# Altium schematic sheet CTR_MCU_Circuits.SchDoc: TMS320 Circuits
size A4; DrawnBy: Andrei Divinagracia; Revision: 0A; SheetNumber: 6; SheetTotal: 10
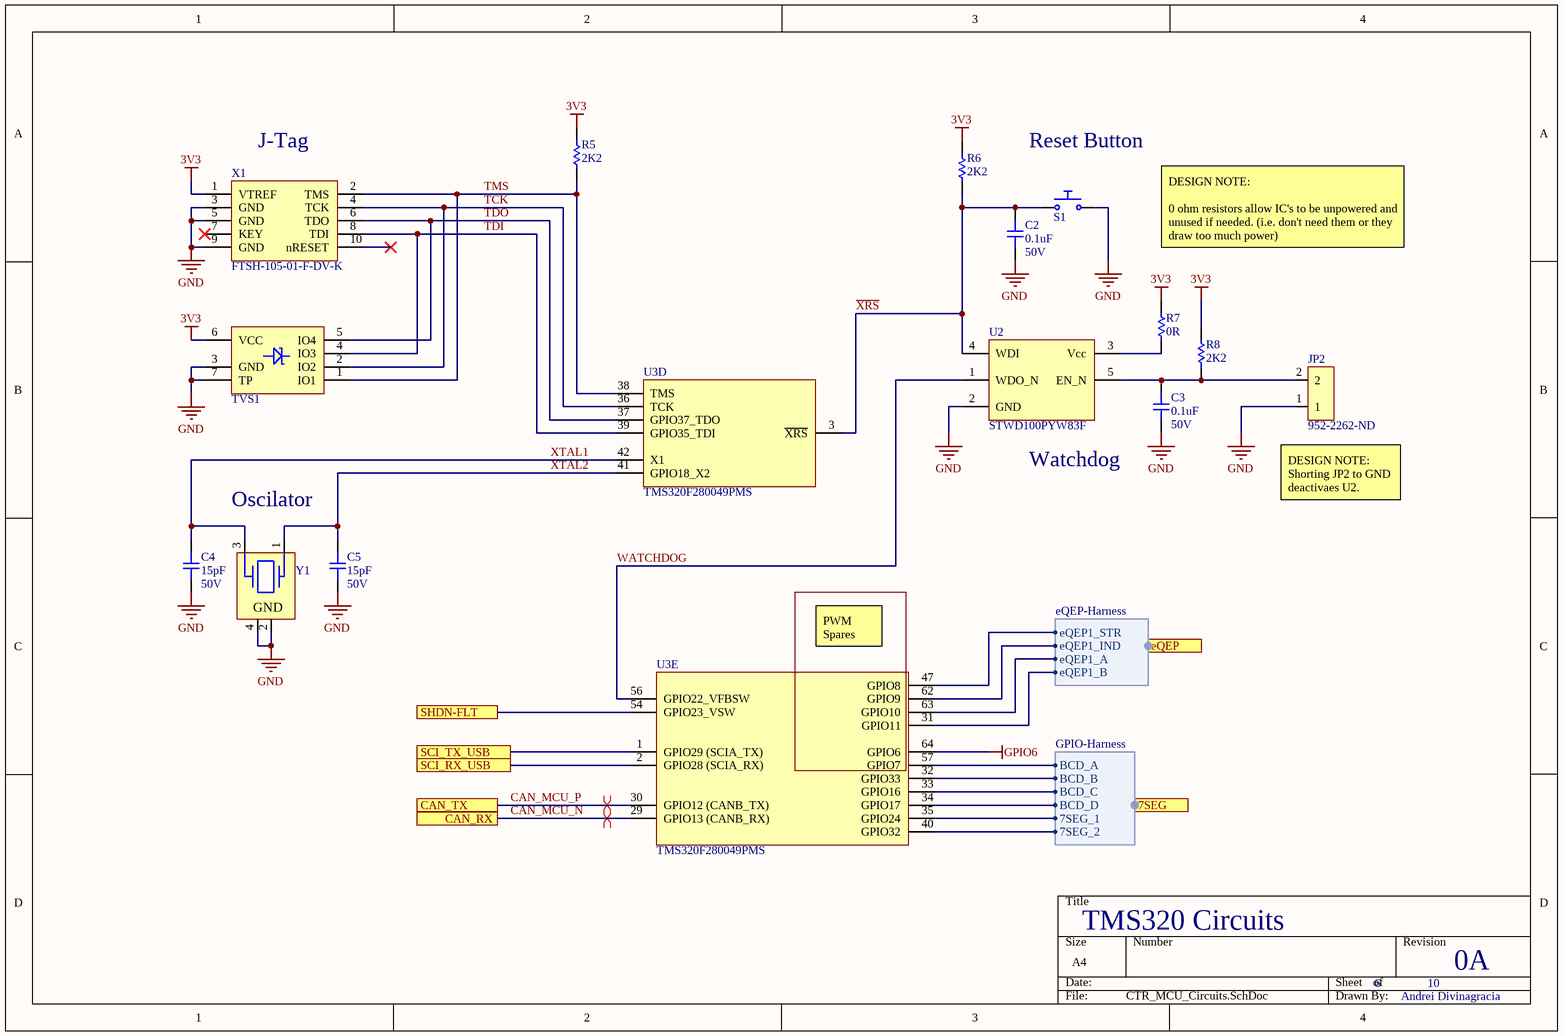
[diagram p0: CTR_MCU_Circuits.SchDoc]

## Parts
C2  0.1uF  Voltage Rating: 50V  [CAP-0805]
C3  0.1uF  Voltage Rating: 50V  [CAP-0805]
C4  15pF  Voltage Rating: 50V  [CAP-0603]
C5  15pF  Voltage Rating: 50V  [CAP-0603]
JP2  952-2262-ND  [2PIN_HEADER]
R5  2K2  [RES-0603]
R6  2K2  [RES-0603]
R7  0R  [RES-0603]
R8  2K2  [RES-0603]
S1  PTS645SM43SMTR92LFS  [PUSH_BUTTON]  (value not drawn)
TVS1  TVS-4-5.5V-Bi  [TVS-DRS-TP-5]  (value not drawn)
U2  STWD100PYW83F  [SOT23-5-WATCHDOG]
U3  TMS320F280049PMS  [64QFP]  (parts D,E of 5)
X1  FTSH-105-01-F-DV-K  [JTAG_50mil_10pin]
Y1  ECS-200-18-30B-AGN-TR  [XTAL-SMD-4]  (value not drawn)

## Ports
7SEG (harness GPIO-Harness), CAN_RX, CAN_TX, eQEP (harness eQEP-Harness), SCI_RX_USB, SCI_TX_USB, SHDN-FLT

## Harnesses
eQEP-Harness: eQEP1_A, eQEP1_B, eQEP1_IND, eQEP1_STR
GPIO-Harness: 7SEG_2, 7SEG_1, BCD_C, BCD_B, BCD_A, BCD_D

## Nets
3V3: R5.1 R6.1 R7.2 R8.2 TVS1.6(VCC) X1.1(VTREF)
GND: C2.1 C3.1 C4.1 C5.1 JP2.1 S1.2 TVS1.3(GND) TVS1.7(TP) U2.2(GND) X1.3(GND) X1.5(GND) X1.9(GND) Y1.2(GND) Y1.4(GND)
GPIO6: U3.64(GPIO6)
CAN_MCU_N: U3.29(GPIO13_(CANB_RX)) ; port CAN_RX
CAN_MCU_P: U3.30(GPIO12_(CANB_TX)) ; port CAN_TX
SCI_RX_USB: U3.2(GPIO28_(SCIA_RX)) ; port SCI_RX_USB
SCI_TX_USB: U3.1(GPIO29_(SCIA_TX)) ; port SCI_TX_USB
SHDN-FLT: U3.54(GPIO23_VSW) ; port SHDN-FLT
TCK: TVS1.2(IO2) U3.36(TCK) X1.4(TCK)
TDI: TVS1.4(IO3) U3.39(GPIO35_TDI) X1.8(TDI)
TDO: TVS1.5(IO4) U3.37(GPIO37_TDO) X1.6(TDO)
TMS: R5.2 TVS1.1(IO1) U3.38(TMS) X1.2(TMS)
WATCHDOG: U2.1(WDO_N) U3.56(GPIO22_VFBSW)
~{XRS}: C2.2 R6.2 S1.1 U2.4(WDI) U3.3(~{XRS})
XTAL1: C4.2 U3.42(X1) Y1.3(OUT)
XTAL2: C5.2 U3.41(GPIO18_X2) Y1.1(IN)
NetC3_2: C3.2 JP2.2 R8.1 U2.5(EN_N)
NetR7_1: R7.1 U2.3(Vcc)
NetU3_31: U3.31(GPIO11) ; port eQEP.eQEP1_B
NetU3_32: U3.32(GPIO33) ; port 7SEG.BCD_B
NetU3_33: U3.33(GPIO16) ; port 7SEG.BCD_C
NetU3_34: U3.34(GPIO17) ; port 7SEG.BCD_D
NetU3_35: U3.35(GPIO24) ; port 7SEG.7SEG_1
NetU3_40: U3.40(GPIO32) ; port 7SEG.7SEG_2
NetU3_47: U3.47(GPIO8) ; port eQEP.eQEP1_STR
NetU3_57: U3.57(GPIO7) ; port 7SEG.BCD_A
NetU3_62: U3.62(GPIO9) ; port eQEP.eQEP1_IND
NetU3_63: U3.63(GPIO10) ; port eQEP.eQEP1_A

Not connected (* = marked no-connect by the designer): X1 7(KEY)* 10(nRESET)*

## Layout directives
differential pair: CAN_MCU_N, CAN_MCU_P

## Notes on the sheet
- (near X1) J-Tag
- Reset Button
- DESIGN NOTE:
  0 ohm resistors allow IC's to be unpowered and unused if needed. (i.e. don't need them or they draw too much power)
- Oscilator
- Watchdog
- (near JP2) DESIGN NOTE:
  Shorting JP2 to GND deactivaes U2.
- (near U3) PWM Spares

## Library data of the parts
C2 C3 = 0805-0.1uF-50V: CAP CER 0.1UF 50V Y5V 0805; Manufacturer: KEMET; Manufacturer Part Number: C0805C104Z5VACTU; Dielectric Material: Ceramic; Tolerance: 80%; Dissipation Factor: 5%; Capacitance: 100nF; Supplier 1: Digi-Key; Stock 1: 929243; Pricing 1: 1=0.1, 10=0.057, 100=0.0254, 500=0.01818, 1000=0.01428 (USD); Mount: Surface Mount,PCB; Case/Package: 0805; Number of Pins: 2; Case Code (Metric): 2012; Case Code (Imperial): 0805; Min Operating Temperature: -30°C; Max Operating Temperature: 85°C; Package Quantity: 1; Packaging: Tape and Reel; Voltage Rating (DC): 50V; Dielectric: Y5V; Termination: SMD/SMT; Voltage: 50V; Length: 2mm; Height: 0.9mm; Lead Pitch: 0.75mm; Width: 0.049inch; Thickness: 0.039inch; Depth: 1.25mm; Radiation Hardening: No; REACH SVHC: No SVHC; Lead Free: Lead Free; ComponentLink1URL: http://www.alliedelec.com/m/d/9bfe7773041ffe9d406e68bc7b377fdd.pdf?src-supplier=Allied+Electronics; ComponentLink1Description: http://www.alliedelec.com/m/d/9bfe7773041ffe9d406e68bc7b377fdd.pdf?src-supplier=Allied+Electronics; ComponentLink2URL: https://www.verical.com/server-webapp/html/getDatasheet?partID=37101&src-supplier=Verical; ComponentLink2Description: https://www.verical.com/server-webapp/html/getDatasheet?partID=37101&src-supplier=Verical; ComponentLink3URL: https://www.verical.com/server-webapp/html/getDatasheet?partID=321176&src-supplier=Verical; ComponentLink3Description: https://www.verical.com/server-webapp/html/getDatasheet?partID=321176&src-supplier=Verical; ComponentLink4URL: http://www.farnell.com/datasheets/2123124.pdf?src-supplier=Element14; ComponentLink4Description: http://www.farnell.com/datasheets/2123124.pdf?src-supplier=Element14; Supplier Part Number 1: 399-1177-6-ND
C4 C5 = 0603-15pF: CAP CER 15PF 50V C0G/NPO 0603; Manufacturer: Yageo; Manufacturer Part Number: CC0603JRNPO9BN150; Dielectric Material: Ceramic; Tolerance: 5%; Dielectric: C0G; Insulation Resistance: 100GR; Supplier 1: Digi-Key; Stock 1: 209662; Pricing 1: 1=0.1, 10=0.046, 50=0.025, 100=0.0203, 500=0.01454, 1000=0.01142 (USD); Mount: Surface Mount; Case/Package: 0603; Number of Pins: 2; Case Code (Metric): 1608; Case Code (Imperial): 0603; Min Operating Temperature: -55°C; Max Operating Temperature: 125°C; Capacitance: 15pF; Packaging: Tape and Reel; Package Quantity: 1; Termination: SMD/SMT; Series: CC; Length: 1.6mm; Width: 0.031inch; Height: 0.8mm; Thickness: 0.035inch; Depth: 0.8mm; Radiation Hardening: No; REACH SVHC: No SVHC; Lead Free: Lead Free; RoHS Compliant: Yes; ComponentLink1URL: http://www.farnell.com/datasheets/1443161.pdf?src-supplier=Element14; ComponentLink1Description: http://www.farnell.com/datasheets/1443161.pdf?src-supplier=Element14; ComponentLink2URL: http://www.yageo.com/documents/recent/UPY-GP_NP0_16V-to-50V_16.pdf?src-supplier=Digi-Key; ComponentLink2Description: http://www.yageo.com/documents/recent/UPY-GP_NP0_16V-to-50V_16.pdf?src-supplier=Digi-Key; ComponentLink3URL: http://www.farnell.com/datasheets/2213336.pdf?src-supplier=Element14; ComponentLink3Description: http://www.farnell.com/datasheets/2213336.pdf?src-supplier=Element14; ComponentLink4URL: http://www.yageo.com/documents/recent/UPY-GP_NP0_16V-to-50V_8.pdf?src-supplier=Avnet; ComponentLink4Description: http://www.yageo.com/documents/recent/UPY-GP_NP0_16V-to-50V_8.pdf?src-supplier=Avnet; ComponentLink5URL: http://www.yageo.com/documents/recent/UPY-GP_NP0_16V-to-50V_8.pdf?src-supplier=Avnet+Europe; ComponentLink5Description: http://www.yageo.com/documents/recent/UPY-GP_NP0_16V-to-50V_8.pdf?src-supplier=Avnet+Europe; Supplier Part Number 1: 311-1060-1-ND
JP2 = M20-9990246: CONN HEADER VERT 2POS 2.54MM; Manufacturer: Harwin; Contact Resistance: 30mR; Max Current Rating: 3A; Number of Positions: 2; Gender: Male; Connector Type: Male Pin; Insulation Resistance: 10GR; Voltage Rating (AC): 750V; Supplier 1: Digi-Key; Manufacturer Part Number: M20-9990246; Stock 1: 53577; Pricing 1: 1=0.11, 10=0.099, 100=0.0609, 500=0.0504, 1000=0.0441, 5000=0.0378, 10000=0.0368 (USD); Case/Package: SIL; Colour: Black; Housing Colour: Black; Housing Material: Nylon; Contact Plating: Tin; Contact Material: Bronze,Brass; Min Operating Temperature: -40°C; Max Operating Temperature: 105°C; Package Quantity: 1000; Packaging: Bulk; Termination: Solder; Number of Rows: 1; Number of Contacts: 2; Orientation: Straight; Current Rating: 3A; Length: 5.08mm; Depth: 2.54mm; Pitch: 2.54mm; Contact Mating Length: 0.24inch; Radiation Hardening: No; REACH SVHC: No SVHC; ComponentLink1URL: https://datasheet.ciiva.com/8046/315376-8046930.pdf; ComponentLink1Description: https://datasheet.ciiva.com/8046/315376-8046930.pdf; ComponentLink2URL: https://datasheet.ciiva.com/6833/m20-999-6833368.pdf; ComponentLink2Description: https://datasheet.ciiva.com/6833/m20-999-6833368.pdf; ComponentLink3URL: https://datasheet.ciiva.com/11745/0900766b81034e61-11745755.pdf; ComponentLink3Description: https://datasheet.ciiva.com/11745/0900766b81034e61-11745755.pdf; ComponentLink4URL: https://datasheet.ciiva.com/22660/1830818-22660571.pdf; ComponentLink4Description: https://datasheet.ciiva.com/22660/1830818-22660571.pdf; ComponentLink5URL: https://datasheet.ciiva.com/26852/getdatasheetpartid-384170-26852203.pdf; ComponentLink5Description: https://datasheet.ciiva.com/26852/getdatasheetpartid-384170-26852203.pdf; Supplier Part Number 1: 952-2262-ND
R5 R6 R8 = 0603-2K2: RES SMD 2.2K OHM 5% 1/10W 0603; Manufacturer: Yageo; Manufacturer Part Number: AC0603JR-072K2L; Resistance: 2.2kR; Power Rating: 100mW; Voltage Rating: 50V; Temperature Coefficient: 100ppm/°C; Supplier 1: Digi-Key; Stock 1: 107229; Pricing 1: 1=0.1, 10=0.024, 100=0.0097, 1000=0.00436, 2500=0.00378 (USD); Case/Package: 0603; Case Code (Imperial): 0603; Case Code (Metric): 1608; Contact Plating: Tin,Matte; Min Operating Temperature: -55°C; Max Operating Temperature: 155°C; Tolerance: 5%; Packaging: Tape and Reel; Resistor Type: Thick Film; Termination: SMD/SMT; Number of Terminations: 2; Max Power Dissipation: 100mW; Features: Moisture Resistant,Automotive AEC-Q200; Series: AC; Length: 0.063inch; Width: 0.8mm; Height: 0.022inch; Radiation Hardening: No; Lead Free: Lead Free; RoHS Compliant: Yes; ComponentLink1URL: http://www.mouser.com/ds/2/447/yageodocoutput-1111992.pdf?src-supplier=Mouser; ComponentLink1Description: http://www.mouser.com/ds/2/447/yageodocoutput-1111992.pdf?src-supplier=Mouser; ComponentLink2URL: http://www.yageo.com/documents/recent/PYu-AC_51_RoHS_L_2_revised.pdf?src-supplier=Avnet+Europe; ComponentLink2Description: http://www.yageo.com/documents/recent/PYu-AC_51_RoHS_L_2_revised.pdf?src-supplier=Avnet+Europe; ComponentLink3URL: http://www.yageo.com/NewPortal/yageodocoutput?fileName=/pdf/R-Chip/PYu-AC_51_RoHS_L_6.pdf&src-supplier=Digi-Key; ComponentLink3Description: http://www.yageo.com/NewPortal/yageodocoutput?fileName=/pdf/R-Chip/PYu-AC_51_RoHS_L_6.pdf&src-supplier=Digi-Key; ComponentLink4URL: https://www.yageo.com/upload/media/product/productsearch/datasheet/rchip/PYu-AC_51_RoHS_L_7.pdf?src-supplier=Digi-Key; ComponentLink4Description: https://www.yageo.com/upload/media/product/productsearch/datasheet/rchip/PYu-AC_51_RoHS_L_7.pdf?src-supplier=Digi-Key; Supplier Part Number 1: YAG3657CT-ND
R7 = 0603-0R: RES SMD 0 OHM JUMPER 1/10W 0603; Manufacturer: Yageo; Manufacturer Part Number: RC0603JR-070RL; Resistance: 0mR; Tolerance: 1%; Voltage Rating: 50V; Power Rating: 100mW; Temperature Coefficient: 200ppm/°C; Supplier 1: Digi-Key; Stock 1: 25658294; Pricing 1: 1=0.1, 10=0.019, 25=0.0136, 50=0.0104, 100=0.0077, 250=0.00588, 500=0.00472, 1000=0.00347 (USD); Case/Package: 0603; Number of Pins: 2; Case Code (Imperial): 0603; Case Code (Metric): 1608; Contact Plating: Tin,Matte; Min Operating Temperature: -55°C; Max Operating Temperature: 155°C; Package Quantity: 5000; Packaging: Tape and Reel; Voltage Rating (DC): 50V; Termination: SMD/SMT; Composition: Thick Film; Military Standard: Not; Length: 1.6mm; Height: 0.45mm; Width: 0.8mm; Depth: 0.8mm; Radiation Hardening: No; REACH SVHC: No SVHC; Lead Free: Lead Free; ComponentLink1URL: http://www.farnell.com/datasheets/2167052.pdf?src-supplier=Element14; ComponentLink1Description: http://www.farnell.com/datasheets/2167052.pdf?src-supplier=Element14; ComponentLink2URL: https://www.verical.com/server-webapp/html/getDatasheet?partID=329462&src-supplier=Verical; ComponentLink2Description: https://www.verical.com/server-webapp/html/getDatasheet?partID=329462&src-supplier=Verical; ComponentLink3URL: http://www.yageo.com/documents/recent/PYu-RC_Group_51_RoHS_L_9.pdf?src-supplier=Mouser; ComponentLink3Description: http://www.yageo.com/documents/recent/PYu-RC_Group_51_RoHS_L_9.pdf?src-supplier=Mouser; ComponentLink4URL: http://www.farnell.com/datasheets/443971.pdf?src-supplier=Element14; ComponentLink4Description: http://www.farnell.com/datasheets/443971.pdf?src-supplier=Element14; ComponentLink5URL: http://documents.rs-components.com/techlib://itc_doclist_GB.htm?stockno=6515918&src-supplier=RSComponents; ComponentLink5Description: http://documents.rs-components.com/techlib://itc_doclist_GB.htm?stockno=6515918&src-supplier=RSComponents; Supplier Part Number 1: 311-0.0GRCT-ND
S1 = PTS645SM43SMTR92LFS: SWITCH TACTILE SPST-NO 0.05A 12V; Manufacturer: ITT C&K; Mechanical Life: 100000Cycles; Actuator Material: Nylon,Polyamide; Throw Configuration: SPST; Contact Resistance: 100mR; Operating Force: 160gf; Max Current Rating: 50mA; Illumination Type: Non-Illuminated,Illuminated; Switch Function: Off-Mom; Actuator Length: 0.85mm; Supplier 1: Digi-Key; Manufacturer Part Number: PTS645SM43SMTR92LFS; Stock 1: 188827; Pricing 1: 1=0.16, 10=0.157, 25=0.1516, 50=0.1462, 100=0.1381, 250=0.13, 500=0.1245 (USD); Mount: Surface Mount; Case/Package: SMD/SMT; Contact Plating: Silver; Contact Material: Silver; Colour: Black; Min Operating Temperature: -20°C; Max Operating Temperature: 60°C; Max Voltage Rating (DC): 12V; Packaging: Tape and Reel; Package Quantity: 1000; Current Rating: 50mA; Voltage Rating (DC): 12V; Termination: Gull Wing; Orientation: Straight; Length: 6mm; Depth: 9mm; REACH SVHC: No SVHC; Lead Free: Lead Free; ComponentLink1URL: https://datasheet.ciiva.com/29903/getdatasheetpartid-786341-29903846.pdf; ComponentLink1Description: https://datasheet.ciiva.com/29903/getdatasheetpartid-786341-29903846.pdf; ComponentLink2URL: https://datasheet.ciiva.com/14920/pts645-14920733.pdf; ComponentLink2Description: https://datasheet.ciiva.com/14920/pts645-14920733.pdf; ComponentLink3URL: https://datasheet.ciiva.com/14920/pts645-14920734.pdf; ComponentLink3Description: https://datasheet.ciiva.com/14920/pts645-14920734.pdf; ComponentLink4URL: https://datasheet.ciiva.com/14920/pts645-14920735.pdf; ComponentLink4Description: https://datasheet.ciiva.com/14920/pts645-14920735.pdf; ComponentLink5URL: https://datasheet.ciiva.com/29931/getdatasheetpartid-764615-29931183.pdf; ComponentLink5Description: https://datasheet.ciiva.com/29931/getdatasheetpartid-764615-29931183.pdf; Supplier Part Number 1: CKN9112CT-ND
TVS1 = TVS-4-5.5V-Bi: TVS DIODE 5.5V 6SON; Manufacturer: Texas Instruments; Manufacturer Part Number: TPD4E001DRSR; Direction: Unidirectional; Capacitance: 1.5pF; Number of Channels: 4; Min Breakdown Voltage: 11V; Peak Pulse Power: 100W; Power Line Protection: Yes; Clamping Voltage: 105.5V; Leakage Current: 1nA; Test Current: 10mA; Peak Pulse Current: 5.5A; Interface: LVDS,USB,Ethernet; Supplier 1: Digi-Key; Stock 1: 16747; Pricing 1: 1=0.67, 10=0.576, 100=0.4304, 500=0.33814 (USD); Number of Pins: 6; Min Operating Temperature: -40°C; Max Operating Temperature: 85°C; Packaging: Tape and Reel; Package Quantity: 1000; Operating Supply Voltage: 5.5V; Number of Bidirectional Channels: 4; Reverse Standoff Voltage: 5.5V; Termination: SMD/SMT; Working Voltage: 5.5V; Max Power Dissipation: 100W; ESD Protection: Yes; Max Reverse Leakage Current: 1nA; Length: 3mm; Width: 3.15mm; Height: 0.75mm; Depth: 3mm; Radiation Hardening: No; REACH SVHC: No SVHC; Lead Free: Lead Free; ComponentLink1URL: http://www.ti.com/lit/ds/symlink/tpd4e001.pdf?src-supplier=Digi-Key; ComponentLink1Description: http://www.ti.com/lit/ds/symlink/tpd4e001.pdf?src-supplier=Digi-Key; ComponentLink2URL: https://www.verical.com/server-webapp/html/getDatasheet?partID=143410&src-supplier=Verical; ComponentLink2Description: https://www.verical.com/server-webapp/html/getDatasheet?partID=143410&src-supplier=Verical; ComponentLink3URL: http://focus.ti.com/lit/ds/symlink/tpd4e001.pdf?src-supplier=Avnet+Europe; ComponentLink3Description: http://focus.ti.com/lit/ds/symlink/tpd4e001.pdf?src-supplier=Avnet+Europe; Supplier Part Number 1: 296-22852-1-ND
U2 = STWD100PYW83F: IC WDT CIRCUIT SOT323-5; Manufacturer: STMicroelectronics; Nominal Supply Current: 13uA; Max Supply Voltage: 5.5V; Max Power Dissipation: 320mW; Min Supply Voltage: 2.7V; Number of Voltages Monitored: 1; Reset: Active Low; Reset Timeout: 1.12s; Output: TOTEM-POLE; Supplier 1: Digi-Key; Manufacturer Part Number: STWD100PYW83F; Stock 1: 10672; Pricing 1: 1=0.87, 10=0.763, 25=0.7164, 100=0.5846, 250=0.543, 500=0.46214, 1000=0.38148 (USD); Mount: Surface Mount; Case/Package: SC; Number of Pins: 5; Weight: 0.000705oz; Min Operating Temperature: -40°C; Max Operating Temperature: 125°C; Package Quantity: 1; Packaging: Tape and Reel; Number of Timers/Counters: 1; Type: Watchdog Circuit; Series: -; Supply Current: 13uA; Length: 2.2mm; Width: 1.35mm; Height: 1mm; REACH SVHC: No SVHC; Lead Free: Lead Free; RoHS Compliant: Yes; ComponentLink1URL: http://www.st.com/content/ccc/resource/sales_and_marketing/promotional_material/flyer/52/2d/7f/6c/74/bb/43/70/flcarefree1213.pdf/files/flcarefree1213.pdf/jcr:content/translations/en.flcarefree1213.pdf?src-supplier=Digi-Key; ComponentLink1Description: http://www.st.com/content/ccc/resource/sales_and_marketing/promotional_material/flyer/52/2d/7f/6c/74/bb/43/70/flcarefree1213.pdf/files/flcarefree1213.pdf/jcr:content/translations/en.flcarefree1213.pdf?src-supplier=Digi-Key; ComponentLink2URL: http://www.st.com/content/ccc/resource/technical/document/datasheet/06/6a/b3/83/9a/c7/4f/22/CD00176077.pdf/files/CD00176077.pdf/jcr:content/translations/en.CD00176077.pdf?src-supplier=Digi-Key; ComponentLink2Description: http://www.st.com/content/ccc/resource/technical/document/datasheet/06/6a/b3/83/9a/c7/4f/22/CD00176077.pdf/files/CD00176077.pdf/jcr:content/translations/en.CD00176077.pdf?src-supplier=Digi-Key; ComponentLink3URL: http://www.st.com/web/en/resource/technical/document/datasheet/CD00176077.pdf?src-supplier=Future+Electronics; ComponentLink3Description: http://www.st.com/web/en/resource/technical/document/datasheet/CD00176077.pdf?src-supplier=Future+Electronics; ComponentLink4URL: http://www.produktinfo.conrad.com/datenblaetter/1100000-1199999/001184854-da-01-en-IC_CIRCU_STWD100PYW83F_SOT_323_5_STM.pdf?src-supplier=Conrad; ComponentLink4Description: http://www.produktinfo.conrad.com/datenblaetter/1100000-1199999/001184854-da-01-en-IC_CIRCU_STWD100PYW83F_SOT_323_5_STM.pdf?src-supplier=Conrad; Supplier Part Number 1: 497-13372-1-ND
U3 = TMS320F280049: IC MCU 32BIT 256KB FLASH 64LQFP; Manufacturer: Texas Instruments; Manufacturer Part Number: F280049CPMS; Number of UART Channels: 2; Interface: I2C,SPI,UART,USART,SCI; Peripherals: Brown-out Detect/Reset,POR,PWM,WDT; Frequency: 100MHz; Number of I/Os: 26; Oscillator Type: Internal; Supplier 1: Mouser; Stock 1: 0; Pricing 1: 1=10.7, 10=9.68, 50=9.23, 100=8.01, 1000=6.07, 10000=6.07 (USD); Case/Package: LQFP; Min Operating Temperature: -40°C; Max Operating Temperature: 125°C; Memory Type: FLASH; Packaging: Tray; Memory Size: 256KB; RoHS Compliant: Yes; ComponentLink1URL: http://www.ti.com/lit/pdf/sprui33?src-supplier=Digi-Key; ComponentLink1Description: http://www.ti.com/lit/pdf/sprui33?src-supplier=Digi-Key; Supplier Part Number 1: 595-F280049CPMS
X1 = CONN-JTAG: CONN_JTAG_10pin .050 Connector Dual Header 10 Position Surface Mount; Manufacturer: Samtec; Max Current Rating: 1.75A; Number of Positions: 10; Connector Type: Male Pin; Pitch: 1.27mm; Row Spacing: 0.05inch; Supplier 1: Digi-Key; Manufacturer Part Number: FTSH-105-01-F-DV-K; Stock 1: 18199; Pricing 1: 1=2.9, 10=2.784, 100=2.32, 500=1.972, 1000=1.682, 5000=1.508 (USD); Mount: Surface Mount; Contact Material: Bronze,Copper; Contact Plating: Nickel,Gold; Colour: Black; Housing Colour: Black; Housing Material: Polymer; Min Operating Temperature: -55°C; Max Operating Temperature: 125°C; Number of Rows: 2; Packaging: Rail/Tube; Package Quantity: 1; Termination: Solder; Number of Contacts: 10; Orientation: Straight; Length: 15.2mm; Height: 3.3mm; Contact Mating Length: 0.12inch; Depth: 3.43mm; Radiation Hardening: No; Lead Free: Lead Free; ComponentLink1URL: https://datasheet.ciiva.com/19461/2046846-19461026.pdf; ComponentLink1Description: https://datasheet.ciiva.com/19461/2046846-19461026.pdf; ComponentLink2URL: https://datasheet.ciiva.com/738/ftsh-1xx-xx-xxx-dv-xxx-mkt-738998.pdf; ComponentLink2Description: https://datasheet.ciiva.com/738/ftsh-1xx-xx-xxx-dv-xxx-mkt-738998.pdf; ComponentLink3URL: https://datasheet.ciiva.com/10245/ftsh-mt-10245273.pdf; ComponentLink3Description: https://datasheet.ciiva.com/10245/ftsh-mt-10245273.pdf; ComponentLink4URL: https://datasheet.ciiva.com/16657/ftsh-mt-16657371.pdf; ComponentLink4Description: https://datasheet.ciiva.com/16657/ftsh-mt-16657371.pdf; ComponentLink5URL: https://datasheet.ciiva.com/15195/getdatasheetpartid-133463-15195260.pdf; ComponentLink5Description: https://datasheet.ciiva.com/15195/getdatasheetpartid-133463-15195260.pdf; Supplier Part Number 1: SAM8796-ND
Y1 = ECS-200-18-30B-AGN-TR: CRYSTAL 20.0000MHZ 18PF SMD; Manufacturer: ECS International; Supplier 1: Digi-Key; Manufacturer Part Number: ECS-200-18-30B-AGN-TR; Stock 1: 2820; Pricing 1: 1=0.69, 10=0.575, 50=0.5176, 100=0.46, 500=0.437 (USD); Supplier Part Number 1: XC2693CT-ND